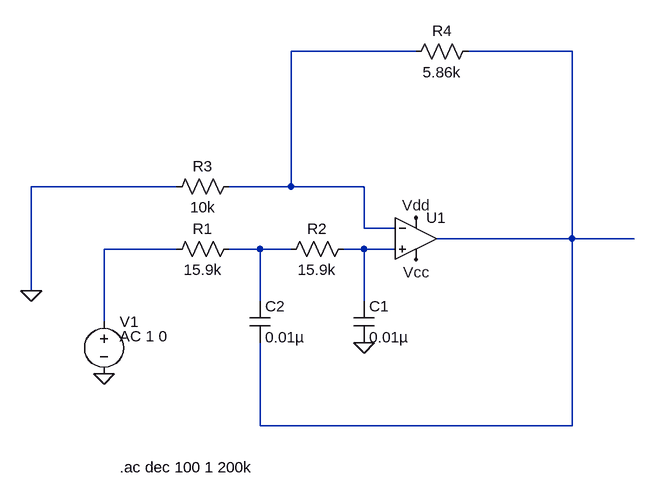
[diagram p0: schematic 2nd order.asc]
2nd order.asc, the LTspice schematic file:
Version 4
SHEET 1 932 688
WIRE 592 32 400 32
WIRE 832 32 672 32
WIRE 224 240 0 240
WIRE 400 240 400 32
WIRE 400 240 304 240
WIRE 512 240 400 240
WIRE 512 304 512 240
WIRE 560 304 512 304
WIRE 832 320 832 32
WIRE 832 320 624 320
WIRE 928 320 832 320
WIRE 224 336 112 336
WIRE 352 336 304 336
WIRE 400 336 352 336
WIRE 512 336 480 336
WIRE 560 336 512 336
WIRE 0 400 0 240
WIRE 352 416 352 336
WIRE 512 416 512 336
WIRE 112 448 112 336
WIRE 352 608 352 480
WIRE 832 608 832 320
WIRE 832 608 352 608
FLAG 112 528 0
FLAG 512 480 0
FLAG 0 400 0
FLAG 592 288 Vdd
FLAG 592 352 Vcc
SYMBOL OpAmps/UniversalOpAmp 592 320 R0
SYMATTR InstName U1
SYMBOL Res 320 320 R90
WINDOW 0 0 56 VBottom 2
WINDOW 3 32 56 VTop 2
SYMATTR InstName R1
SYMATTR Value 15.9k
SYMBOL Res 496 320 R90
WINDOW 0 0 56 VBottom 2
WINDOW 3 32 56 VTop 2
SYMATTR InstName R2
SYMATTR Value 15.9k
SYMBOL Voltage 112 432 R0
WINDOW 123 24 38 Left 2
WINDOW 39 0 0 Left 0
SYMATTR InstName V1
SYMATTR Value ""
SYMATTR Value2 AC 1 0
SYMBOL Cap 496 416 R0
SYMATTR InstName C1
SYMATTR Value 0.01µ
SYMBOL Cap 336 416 R0
SYMATTR InstName C2
SYMATTR Value 0.01µ
SYMBOL Res 320 224 R90
WINDOW 0 0 56 VBottom 2
WINDOW 3 32 56 VTop 2
SYMATTR InstName R3
SYMATTR Value 10k
SYMBOL Res 688 16 R90
WINDOW 0 0 56 VBottom 2
WINDOW 3 32 56 VTop 2
SYMATTR InstName R4
SYMATTR Value 5.86k
TEXT 136 672 Left 2 !.ac dec 100 1 200k

The netlist it stands for:
* 2nd order.asc
XU1 N005 N001 Vdd Vcc N002 level1 Avol=1Meg GBW=10Meg Vos=0 En=0 Enk=0 In=0 Ink=0 Rin=500Meg  ; pins In+ In- V+ V- OUT
R1 N004 N003 15.9k
R2 N005 N004 15.9k
V1 N003 0 AC 1 0
C1 N005 0 0.01µ
C2 N004 N002 0.01µ
R3 N001 0 10k
R4 N002 N001 5.86k
.ac dec 100 1 200k
.lib UniversalOpAmp1.lib
.backanno
.end